# EAGLE design Relay Sequencer (EAGLE 7.7.0)
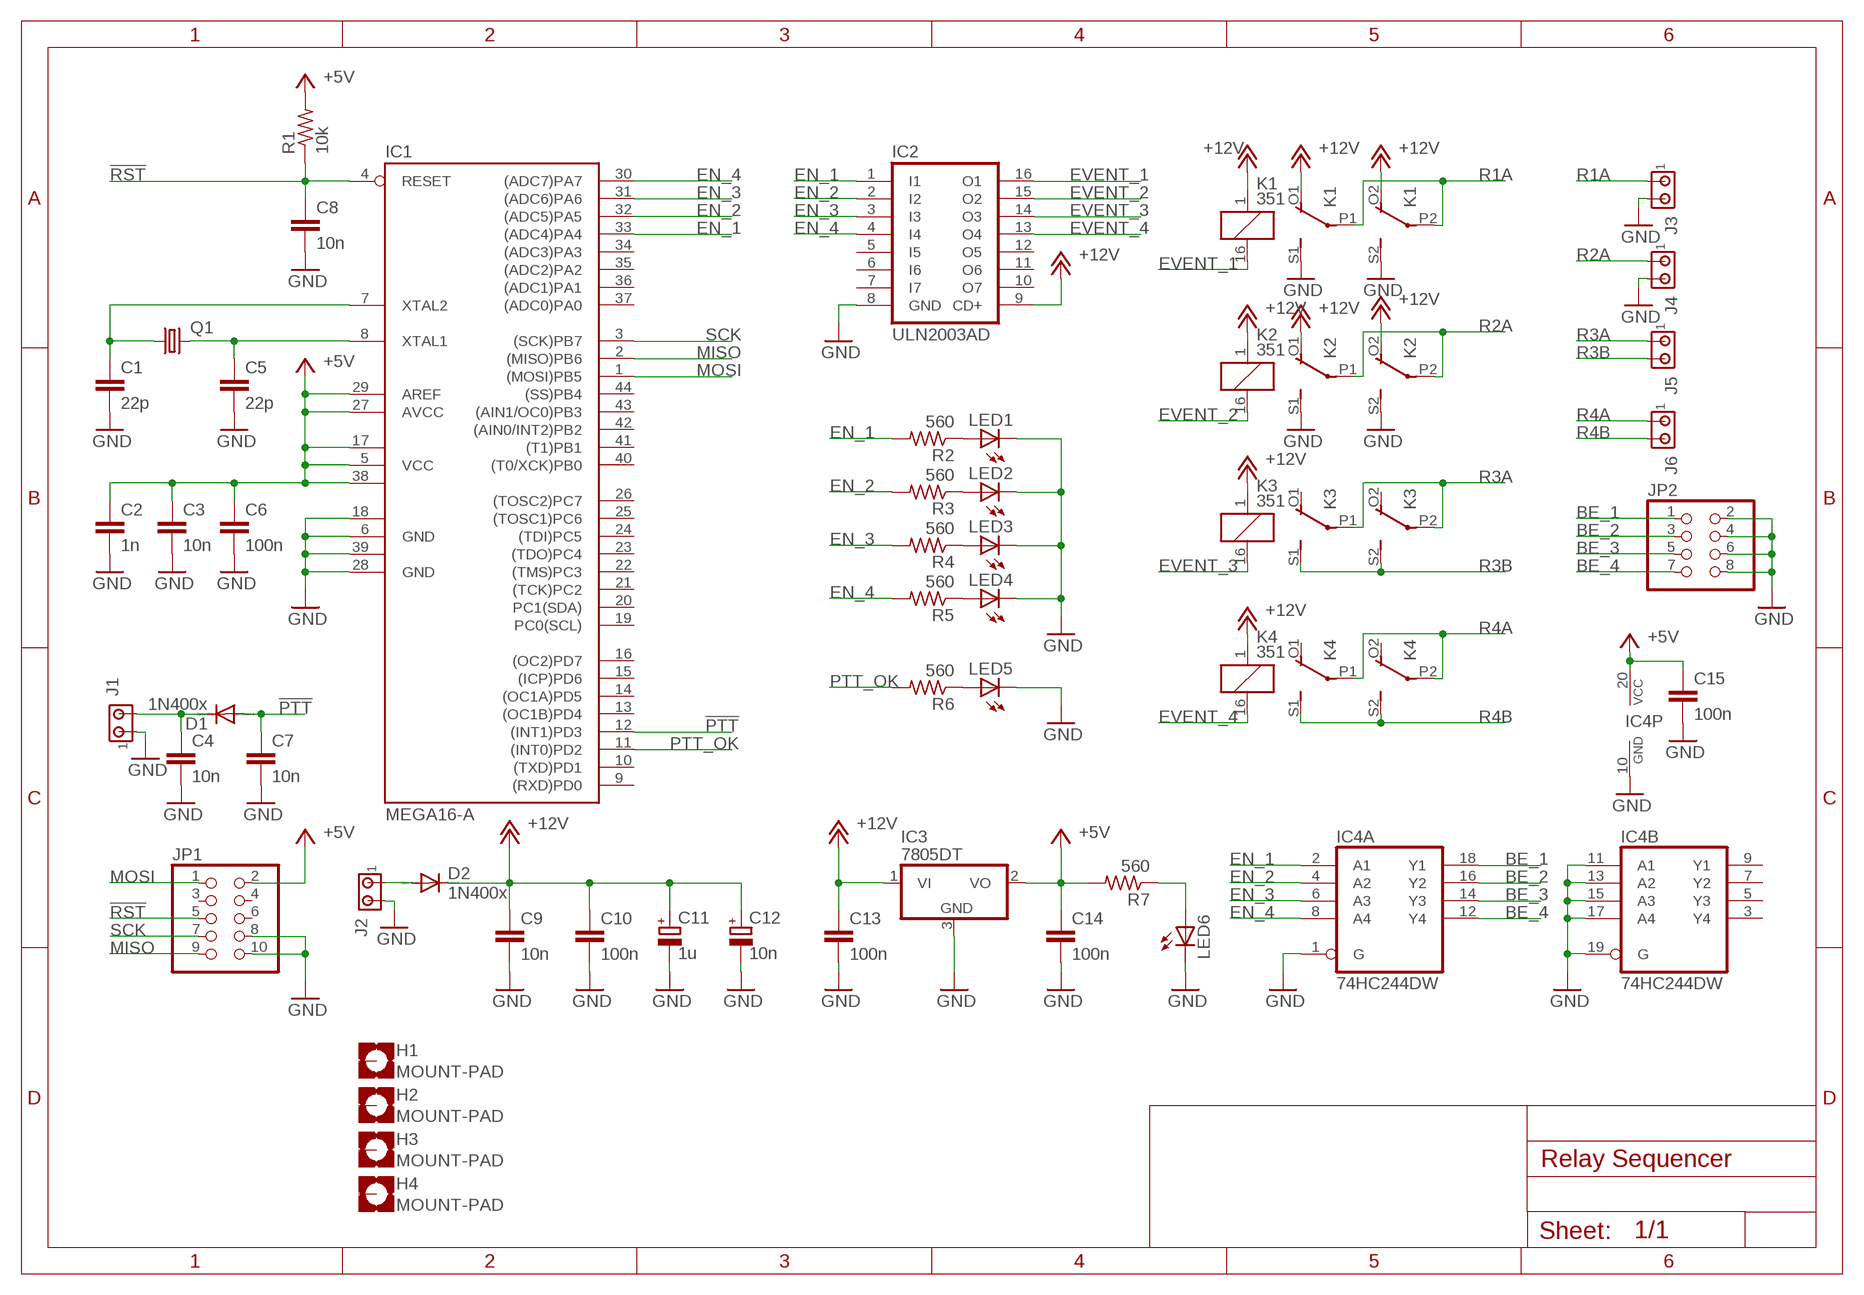
[diagram p0: schematic, sheet 1]

## Parts
C1  22p  C-EUC1206  [C1206]
C2  1n  C-EUC1206  [C1206]
C3  10n  C-EUC1206  [C1206]
C4  10n  C-EUC1206  [C1206]
C5  22p  C-EUC1206  [C1206]
C6  100n  C-EUC1206  [C1206]
C7  10n  C-EUC1206  [C1206]
C8  10n  C-EUC1206  [C1206]
C9  10n  C-EUC1206  [C1206]
C10  100n  C-EUC1206  [C1206]
C11  1u  CPOL-EUE5-8.5  [E5-8,5]
C12  10n  CPOL-EUE5-13  [E5-13]
C13  100n  C-EUC1206  [C1206]
C14  100n  C-EUC1206  [C1206]
C15  100n  C-EUC1206  [C1206]
D1  1N400x  1N4148DO35-10  [DO35-10]
D2  1N400x  1N4148DO35-10  [DO35-10]
H1  MOUNT-PAD  MOUNT-PAD-SQUARE2.8  [2,8-PAD-SQUARE]
H2  MOUNT-PAD  MOUNT-PAD-SQUARE2.8  [2,8-PAD-SQUARE]
H3  MOUNT-PAD  MOUNT-PAD-SQUARE2.8  [2,8-PAD-SQUARE]
H4  MOUNT-PAD  MOUNT-PAD-SQUARE2.8  [2,8-PAD-SQUARE]
IC1  MEGA16-A  [TQFP44]
IC2  ULN2003AD  [SO16]
IC3  7805DT  [TO252]
IC4  74HC244DW  [SO20W]
J1  MTA02-156  [1X2MTA]
J2  MTA02-156  [1X2MTA]
J3  MTA02-156  [1X2MTA]
J4  MTA02-156  [1X2MTA]
J5  MTA02-156  [1X2MTA]
J6  MTA02-156  [1X2MTA]
JP1  PINHD-2X5  [2X05]
JP2  PINHD-2X4  [2X04]
K1  351  [351]
K2  351  [351]
K3  351  [351]
K4  351  [351]
LED1  LED3MM  [LED3MM]
LED2  LED3MM  [LED3MM]
LED3  LED3MM  [LED3MM]
LED4  LED3MM  [LED3MM]
LED5  LED3MM  [LED3MM]
LED6  LED3MM  [LED3MM]
Q1  CRYSTALHC49S  [HC49/S]
R1  10k  R-US_M1206  [M1206]
R2  560  R-US_M1206  [M1206]
R3  560  R-US_M1206  [M1206]
R4  560  R-US_M1206  [M1206]
R5  560  R-US_M1206  [M1206]
R6  560  R-US_M1206  [M1206]
R7  560  R-US_M1206  [M1206]

## Nets
!PTT: C7.1 D1.A IC1.12((INT1)PD3)
!RST: C8.1 IC1.4(RESET) JP1.5 R1.1
+5V: C2.1 C3.1 C6.1 C14.1 C15.1 IC1.5(VCC) IC1.17(VCC1) IC1.27(AVCC) IC1.29(AREF) IC1.38(VCC2) IC3.2(VO) IC4.20(P:VCC) JP1.2 R1.2 R7.2
+12V: C9.1 C10.1 C11.+ C12.+ C13.1 D2.C IC2.9(CD+) IC3.1(VI) K1.1 K1.O1(2:O) K1.O2(3:O) K2.1 K2.O1(2:O) K2.O2(3:O) K3.1 K4.1
BE_1: IC4.18(A:Y1) JP2.1
BE_2: IC4.16(A:Y2) JP2.3
BE_3: IC4.14(A:Y3) JP2.5
BE_4: IC4.12(A:Y4) JP2.7
EN_1: IC1.33((ADC4)PA4) IC2.1(I1) IC4.2(A:A1) R2.2
EN_2: IC1.32((ADC5)PA5) IC2.2(I2) IC4.4(A:A2) R3.2
EN_3: IC1.31((ADC6)PA6) IC2.3(I3) IC4.6(A:A3) R4.2
EN_4: IC1.30((ADC7)PA7) IC2.4(I4) IC4.8(A:A4) R5.2
EVENT_1: IC2.16(O1) K1.16
EVENT_2: IC2.15(O2) K2.16
EVENT_3: IC2.14(O3) K3.16
EVENT_4: IC2.13(O4) K4.16
GND: C1.2 C2.2 C3.2 C4.2 C5.2 C6.2 C7.2 C8.2 C9.2 C10.2 C11.- C12.- C13.2 C14.2 C15.2 IC1.6(GND) IC1.18(GND1) IC1.28(GND) IC1.39(GND2) IC2.8(GND) IC3.3(GND) IC4.1(A:G) IC4.10(P:GND) IC4.11(B:A1) IC4.13(B:A2) IC4.15(B:A3) IC4.17(B:A4) IC4.19(B:G) J1.1 J2.2 J3.2 J4.2 JP1.8 JP1.10 JP2.2 JP2.4 JP2.6 JP2.8 K1.S1(2:S) K1.S2(3:S) K2.S1(2:S) K2.S2(3:S) LED1.K(C) LED2.K(C) LED3.K(C) LED4.K(C) LED5.K(C) LED6.K(C)
MISO: IC1.2((MISO)PB6) JP1.9
MOSI: IC1.1((MOSI)PB5) JP1.1
N$1: C5.1 IC1.8(XTAL1) Q1.2
N$2: C1.1 IC1.7(XTAL2) Q1.1
N$3: LED3.A R4.1
N$4: LED4.A R5.1
N$5: LED1.A R2.1
N$6: LED2.A R3.1
N$7: LED5.A R6.1
N$8: C4.1 D1.C J1.2
N$9: D2.A J2.1
N$10: LED6.A R7.1
PTT_OK: IC1.11((INT0)PD2) R6.2
R1A: J3.1 K1.P1(2:P) K1.P2(3:P)
R2A: J4.1 K2.P1(2:P) K2.P2(3:P)
R3A: J5.1 K3.P1(2:P) K3.P2(3:P)
R3B: J5.2 K3.S1(2:S) K3.S2(3:S)
R4A: J6.1 K4.P1(2:P) K4.P2(3:P)
R4B: J6.2 K4.S1(2:S) K4.S2(3:S)
SCK: IC1.3((SCK)PB7) JP1.7
Unconnected: H1.B2,8(MOUNT) H2.B2,8(MOUNT) H3.B2,8(MOUNT) H4.B2,8(MOUNT) IC1.9((RXD)PD0) IC1.10((TXD)PD1) IC1.13((OC1B)PD4) IC1.14((OC1A)PD5) IC1.15((ICP)PD6) IC1.16((OC2)PD7) IC1.19(PC0(SCL)) IC1.20(PC1(SDA)) IC1.21((TCK)PC2) IC1.22((TMS)PC3) IC1.23((TDO)PC4) IC1.24((TDI)PC5) IC1.25((TOSC1)PC6) IC1.26((TOSC2)PC7) IC1.34((ADC3)PA3) IC1.35((ADC2)PA2) IC1.36((ADC1)PA1) IC1.37((ADC0)PA0) IC1.40((T0/XCK)PB0) IC1.41((T1)PB1) IC1.42((AIN0/INT2)PB2) IC1.43((AIN1/OC0)PB3) IC1.44((SS)PB4) IC2.5(I5) IC2.6(I6) IC2.7(I7) IC2.10(O7) IC2.11(O6) IC2.12(O5) IC4.3(B:Y4) IC4.5(B:Y3) IC4.7(B:Y2) IC4.9(B:Y1) JP1.3 JP1.4 JP1.6 K3.O1(2:O) K3.O2(3:O) K4.O1(2:O) K4.O2(3:O)

## Library data of the parts
C1-C10 C13-C15 = rcl:C-EU: CAPACITOR, European symbol
C11 C12 = rcl:CPOL-EU: POLARIZED CAPACITOR, European symbol
D1 D2 = diode:1N4148: DIODE high speed (Philips)
H1-H4 = holes:MOUNT-PAD-SQUARE: MOUNTING PAD, square
IC1 = atmel:MEGA16: MICROCONTROLLER 16 Kbytes FLASH 1 kbytes SRAM 512 bytes EEPROM USART 8-channel 10 bit ADC Source: avr.lbr; MPN: ATMEGA16-16AU; OC_FARNELL: 9171134; OC_NEWARK: 96K6515
IC2 = uln-udn:ULN2003A: DRIVER ARRAY
IC3 = linear:78*: Positive VOLTAGE REGULATOR Source: http://cache.national.com/ds/LM/LM78L05.pdf http://www.fairchildsemi.com/ds/LM/LM7805.pdf
IC4 = 74xx-eu:74*244: Octal BUFFER and LINE DRIVER, 3-state
J1-J6 = con-amp:MTA02-156: AMP connector
JP1 = pinhead:PINHD-2X5: PIN HEADER
JP2 = pinhead:PINHD-2X4: PIN HEADER
K1-K4 = relay:351: RELAY 2 x switch, Omron; OC_FARNELL: unknown; OC_NEWARK: unknown
LED1-LED6 = led:LED: LED OSRAM: - CHIPLED LG R971, LG N971, LY N971, LG Q971, LY Q971, LO R971, LY R971 LH N974, LH R974 LS Q976, LO Q976, LY Q976 LO Q996 - Hyper CHIPLED LW Q18S LB Q993, LB Q99A, LB R99A - SideLED LS A670, LO A670, LY A670, LG A670, LP A670 LB A673, LV A673, LT A673, LW A673 LH A674 LY A675 LS A676, LA A676, LO A676, LY A676, LW A676 LS A679, LY A679, LG A679 - Hyper Micro SIDELED® LS Y876, LA Y876, LO Y876, LY Y876 LT Y87S - SmartLED LW L88C, LW L88S LB L89C, LB L89S, LG L890 LS L89K, LO L89K, LY L89K LS L896, LA L896, LO L896, LY L896 - TOPLED LS T670, LO T670, LY T670, LG T670, LP T670 LSG T670, LSP T670, LSY T670, LOP T670, LYG T670 LG T671, LOG T671, LSG T671 LB T673, LV T673, LT T673, LW T673 LH T674 LS T676, LA T676, LO T676, LY T676, LB T676, LH T676, LSB T676, LW T676 LB T67C, LV T67C, LT T67C, LS T67K, LO T67K, LY T67K, LW E67C LS E67B, LA E67B, LO E67B, LY E67B, LB E67C, LV E67C, LT E67C LW T67C LS T679, LY T679, LG T679 LS T770, LO T770, LY T770, LG T770, LP T770 LB T773, LV T773, LT T773, LW T773 LH T774 LS E675, LA E675, LY E675, LS T675 LS T776, LA T776, LO T776, LY T776, LB T776 LHGB T686 LT T68C, LB T68C - Hyper Mini TOPLED® LB M676 - Mini TOPLED Santana® LG M470 LS M47K, LO M47K, LY M47K Source: http://www.osram.convergy.de LUXEON: - LUMILED® LXK2-PW12-R00, LXK2-PW12-S00, LXK2-PW14-U00, LXK2-PW14-V00 LXK2-PM12-R00, LXK2-PM12-S00, LXK2-PM14-U00 LXK2-PE12-Q00, LXK2-PE12-R00, LXK2-PE12-S00, LXK2-PE14-T00, LXK2-PE14-U00 LXK2-PB12-K00, LXK2-PB12-L00, LXK2-PB12-M00, LXK2-PB14-N00, LXK2-PB14-P00, LXK2-PB14-Q00 LXK2-PR12-L00, LXK2-PR12-M00, LXK2-PR14-Q00, LXK2-PR14-R00 LXK2-PD12-Q00, LXK2-PD12-R00, LXK2-PD12-S00 LXK2-PH12-R00, LXK2-PH12-S00 LXK2-PL12-P00, LXK2-PL12-Q00, LXK2-PL12-R00 Source: www.luxeon.com KINGBRIGHT: KA-3528ASYC Source: www.kingbright.com
Q1 = crystal:CRYSTAL: CRYSTAL; OC_FARNELL: 1667008; OC_NEWARK: unknown
R1-R7 = rcl:R-US_: RESISTOR, American symbol

## Board
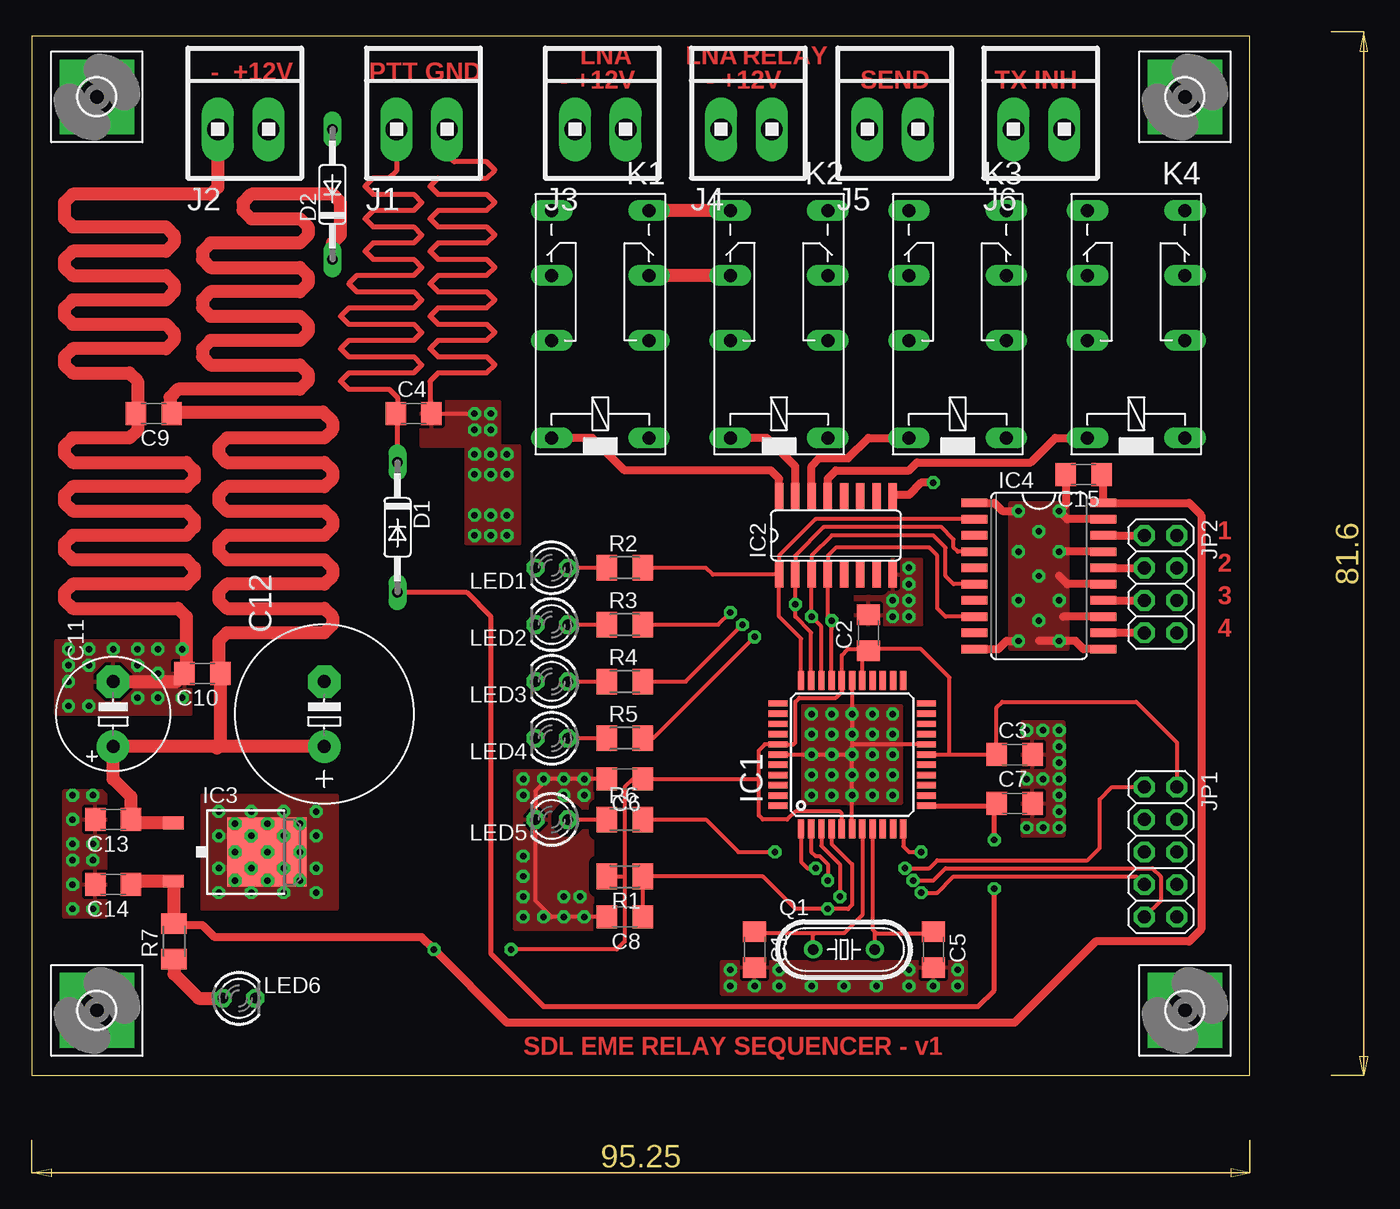
[diagram p1: board, top side]
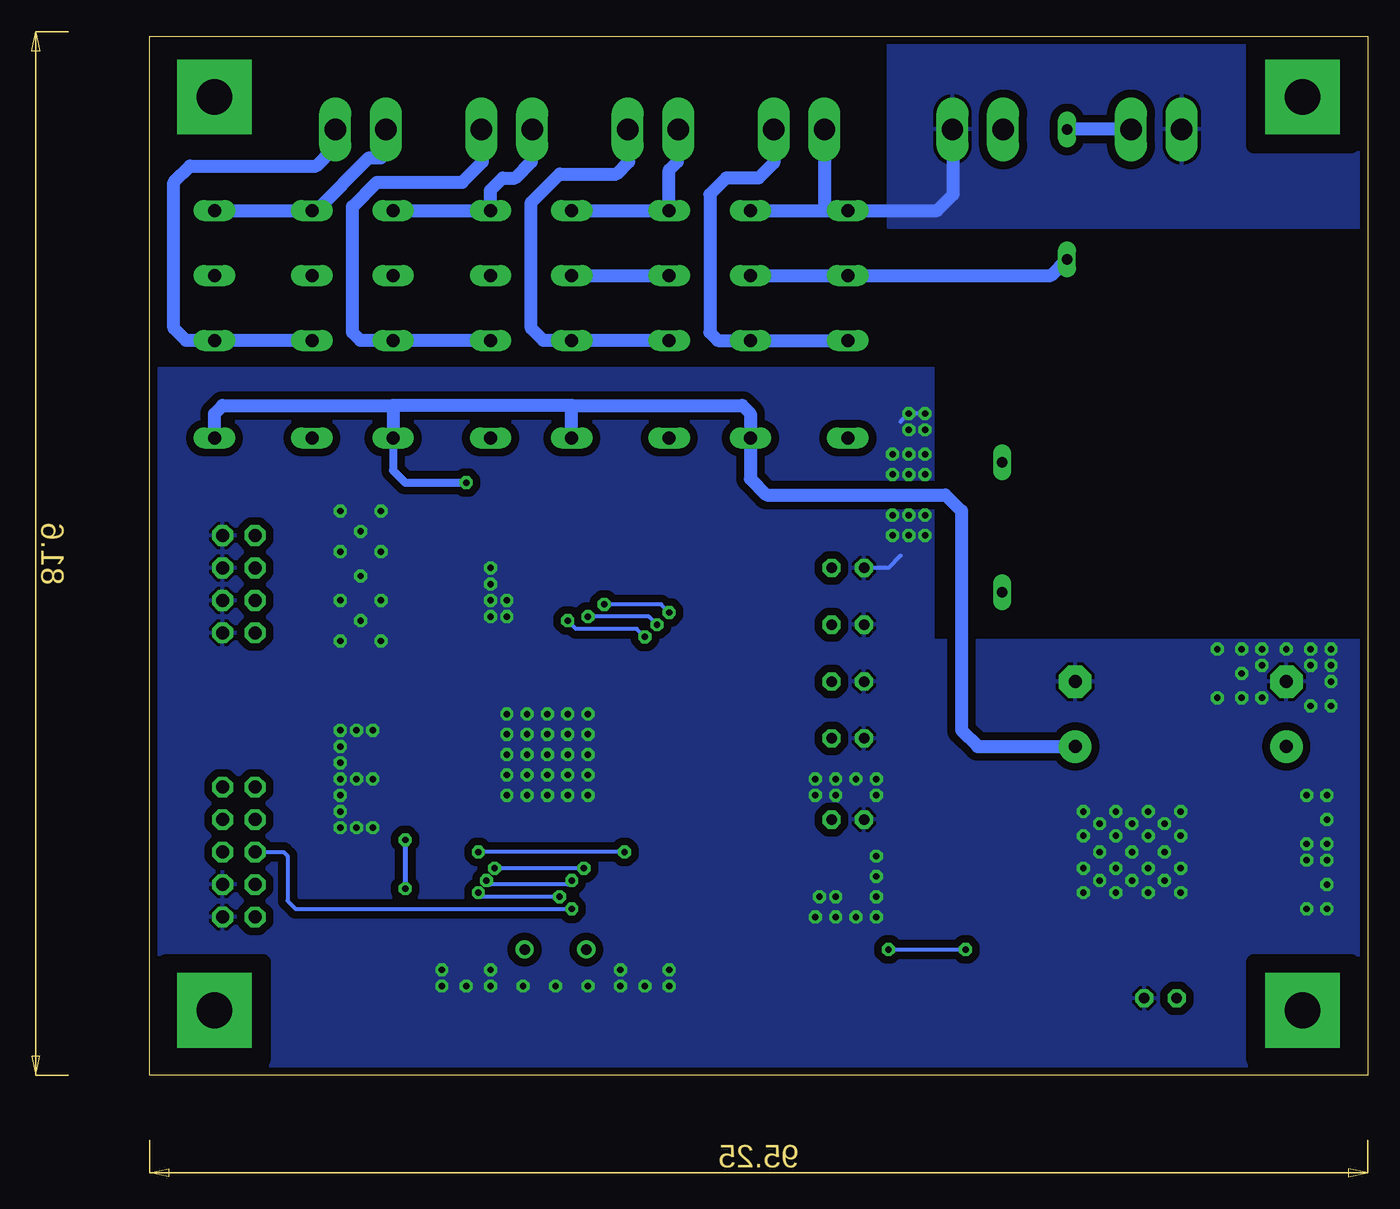
[diagram p2: board, bottom side, seen from below]

Size 95.23 x 81.27 mm. Coordinates in mm from the lower left corner, seen from the top.
Outline: 0,0 95.23,0 95.23,81.27 0,81.27 0,0
Copper layers (1*16): Top 0.035mm / dielectric 1.5mm / Bottom 0.035mm
Design rules "SparkFun": minimum track width 8mil, minimum drill 20mil, track to track 8mil, track to pad 8mil, pad to pad 8mil, via to via 8mil, smd to smd 8mil, copper to edge 10mil, drill to drill 8mil, minimum pad ring 12mil, minimum via ring 10mil, stop-mask expansion 4mil, vias tented up to drill 25mil, thermal gap 10mil
bRestrict: area 1.3,1.3 to 8.9,8.9; area 86.4,1.3 to 94,8.9; area 1.3,72.7 to 8.9,80.3; area 86.4,72.7 to 94,80.3

### Footprints (pad centres in the part's own frame; a part is rotated, then mirrored left to right if it is on the bottom)
C1206 = smd 1.6 x 1.8: 1 -1.4,0; 2 1.4,0
E5-8,5 = drill 1.016 pad 2.54: + -2.54,0 | drill 1.016 pad 2.54 octagon: - 2.54,0
E5-13 = drill 1.016 pad 2.54: + -2.54,0 | drill 1.016 pad 2.54 octagon: - 2.54,0
DO35-10 = drill 0.813 long: A 5.08,0; C -5.08,0
2,8-PAD-SQUARE = drill 2.8 pad 5.842 square: B2,8 0,0
TQFP44 = smd 1.5 x 0.5: 1 -5.8,4; 2 -5.8,3.2; 3 -5.8,2.4; 4 -5.8,1.6; 5 -5.8,0.8; 6 -5.8,0; 7 -5.8,-0.8; 8 -5.8,-1.6; 9 -5.8,-2.4; 10 -5.8,-3.2; 11 -5.8,-4; 23 5.8,-4; 24 5.8,-3.2; 25 5.8,-2.4; 26 5.8,-1.6; 27 5.8,-0.8; 28 5.8,0; 29 5.8,0.8; 30 5.8,1.6; 31 5.8,2.4; 32 5.8,3.2; 33 5.8,4 | smd 0.5 x 1.5: 12 -4,-5.8; 13 -3.2,-5.8; 14 -2.4,-5.8; 15 -1.6,-5.8; 16 -0.8,-5.8; 17 0,-5.8; 18 0.8,-5.8; 19 1.6,-5.8; 20 2.4,-5.8; 21 3.2,-5.8; 22 4,-5.8; 34 4,5.8; 35 3.2,5.8; 36 2.4,5.8; 37 1.6,5.8; 38 0.8,5.8; 39 0,5.8; 40 -0.8,5.8; 41 -1.6,5.8; 42 -2.4,5.8; 43 -3.2,5.8; 44 -4,5.8
SO16 = smd 0.66 x 2.032: 1 -4.445,-3.073; 2 -3.175,-3.073; 3 -1.905,-3.073; 4 -0.635,-3.073; 5 0.635,-3.073; 6 1.905,-3.073; 7 3.175,-3.073; 8 4.445,-3.073; 9 4.445,3.073; 10 3.175,3.073; 11 1.905,3.073; 12 0.635,3.073; 13 -0.635,3.073; 14 -1.905,3.073; 15 -3.175,3.073; 16 -4.445,3.073
TO252 = smd 1 x 1.6: 1 -2.28,-4.8; 2 2.28,-4.8 | smd 5.4 x 6.2: 3 0,2.5
SO20W = smd 0.66 x 2.032: 1 -5.715,-5.029; 2 -4.445,-5.029; 3 -3.175,-5.029; 4 -1.905,-5.029; 5 -0.635,-5.029; 6 0.635,-5.029; 7 1.905,-5.029; 8 3.175,-5.029; 9 4.445,-5.029; 10 5.715,-5.029; 11 5.715,5.029; 12 4.445,5.029; 13 3.175,5.029; 14 1.905,5.029; 15 0.635,5.029; 16 -0.635,5.029; 17 -1.905,5.029; 18 -3.175,5.029; 19 -4.445,5.029; 20 -5.715,5.029
1X2MTA = drill 1.676 long: 1 1.981,0; 2 -1.981,0
2X05 = drill 1.016 octagon: 1 -5.08,-1.27; 2 -5.08,1.27; 3 -2.54,-1.27; 4 -2.54,1.27; 5 0,-1.27; 6 0,1.27; 7 2.54,-1.27; 8 2.54,1.27; 9 5.08,-1.27; 10 5.08,1.27
2X04 = drill 1.016 octagon: 1 -3.81,-1.27; 2 -3.81,1.27; 3 -1.27,-1.27; 4 -1.27,1.27; 5 1.27,-1.27; 6 1.27,1.27; 7 3.81,-1.27; 8 3.81,1.27
351 = drill 1.016 long: 1 -3.81,-3.81; 16 -3.81,3.81; O1 8.89,-3.81; O2 8.89,3.81; P1 3.81,-3.81; P2 3.81,3.81; S1 13.97,-3.81; S2 13.97,3.81
LED3MM = drill 0.813 octagon: A -1.27,0; K 1.27,0
HC49/S = drill 0.813: 1 -2.413,0; 2 2.413,0
M1206 = smd 1.6 x 2: 1 -1.4,0; 2 1.4,0

### Placement (x,y rotation side)
C1  56.52,9.84 270 top
C2  65.41,34.61 90 top
C3  76.83,25.08 0 top
C4  29.84,51.75 0 top
C5  70.48,9.84 270 top
C6  46.35,23.18 180 top
C7  76.83,21.27 0 top
C8  46.35,12.38 180 top
C9  9.53,51.75 180 top
C10  13.34,31.43 180 top
C11  6.35,28.26 90 top
C12  22.86,28.26 90 top
C13  6.35,20 180 top
C14  6.35,14.92 180 top
C15  82.23,46.99 180 top
D1  28.57,42.86 270 top
D2  23.5,68.9 90 top
H1  90.17,5.08 0 top
H2  5.08,76.52 0 top
H3  90.17,76.52 0 top
H4  5.08,5.08 0 top
IC1  64.14,25.08 90 top
IC2  62.87,42.23 0 top
IC3  15.88,17.46 270 top
IC4  78.74,39.05 270 top
J1  30.48,73.98 0 top
J2  16.51,73.98 0 top
J3  44.45,73.98 0 top
J4  55.88,73.98 0 top
J5  67.31,73.98 0 top
J6  78.74,73.98 0 top
JP1  88.27,17.46 270 top
JP2  88.27,38.42 270 top
K1  44.45,53.66 90 top
K2  58.42,53.66 90 top
K3  72.39,53.66 90 top
K4  86.36,53.66 90 top
LED1  40.64,39.69 180 top
LED2  40.64,35.24 180 top
LED3  40.64,30.8 180 top
LED4  40.64,26.35 180 top
LED5  40.64,20 180 top
LED6  16.19,6.03 0 top
Q1  63.5,9.84 0 top
R1  46.35,15.56 180 top
R2  46.35,39.69 0 top
R3  46.35,35.24 0 top
R4  46.35,30.8 0 top
R5  46.35,26.35 0 top
R6  46.35,20 0 top
R7  11.11,10.48 90 top

### Tracks (layer width: path | path; a pad name or v marks a point on that pad's centre or on a via)
!PTT  (via drill 0.5 pad 0.61)
  Top 0.305: 75.56,21.14 C7.1
  Top 0.406: IC1.12 75.25,21.08 C7.1 75.25,21.09 v75.25,18.42 | D1.A 33.97,37.78 35.88,35.88 35.88,9.53 40.01,5.4 73.98,5.4 75.25,6.67 v75.25,14.61
  Bottom 0.406: v75.25,18.42 v75.25,14.61
!RST  (via drill 0.5 pad 0.61)
  Top 0.305: C8.1 R1.1 57.15,15.56 59.69,13.02 v62.23,13.02 63.82,13.02 64.14,13.34 64.14,16.51 62.53,18.11 IC1.4
  Bottom 0.305: JP1.5 84.77,17.46 84.45,17.15 84.45,13.65 83.82,13.02 v62.23,13.02
+5V  (via drill 0.5 pad 0.61)
  Top 0.305: IC1.27 64.94,32.74 C2.1 | 71.75,25.08 C3.1 75.44,28.76 75.88,29.21 86.36,29.21 89.53,26.04 JP1.2 | 46.35,15.56 46.35,22.54 46.99,23.18 C6.1 56.83,23.18 | 46.35,15.56 46.35,10.48 45.72,9.84 v37.47,9.84 | R1.2 46.35,15.56 | IC1.17 71.75,25.08 | 71.75,25.08 71.75,31.12 69.53,33.34 65.53,33.34 C2.1 | C2.1 65.28,33.34 63.82,33.34 63.34,32.86 IC1.29 63.34,30 62.87,29.53 60.01,29.53 59.69,29.21 59.69,26.04 59.54,25.88 IC1.38 57.31,25.88 56.83,25.4 56.83,23.18 | IC1.5 63.34,20.49 63.18,20.64 59.69,20.64 59.05,20 57.15,20 56.83,20.32 56.83,23.18
  Top 0.61: R7.2 11.24,11.75 13.34,11.75 14.29,10.79 30.48,10.79 v31.43,9.84 37.15,4.13 76.83,4.13 83.19,10.48 90.49,10.48 91.44,11.43 91.44,43.82 90.49,44.77 IC4.20 83.77,46.85 C15.1
  Top 1.016: C14.1 8.01,15.18 IC3.2 11.11,15.15 R7.2
  Bottom 0.305: v37.47,9.84 v31.43,9.84
+12V  (via drill 0.5 pad 0.61)
  Top 0.61: v70.48,46.36 69.53,46.36 68.58,45.4 67.41,45.4 IC2.9
  Top 1.016: D2.C 23.5,65.09 24.13,65.72 24.13,68.26 23.5,68.9 17.14,68.9 16.51,68.26 16.51,67.63 17.14,66.99 20.95,66.99 21.59,66.36 21.59,65.72 20.95,65.09 13.97,65.09 13.34,64.45 13.34,63.82 13.97,63.18 20.95,63.18 21.59,62.55 21.59,61.91 20.95,61.28 13.97,61.28 13.34,60.64 13.34,60.01 13.97,59.37 20.95,59.37 21.59,58.74 21.59,58.1 20.95,57.47 13.97,57.47 13.34,56.83 13.34,56.2 13.97,55.56 20.95,55.56 21.59,54.93 21.59,54.29 20.95,53.66 11.43,53.66 10.79,53.02 10.79,51.88 | 10.79,51.88 C9.1 | 10.79,51.88 22.73,51.88 23.5,51.12 23.5,50.48 22.86,49.85 15.24,49.85 14.61,49.21 14.61,48.58 15.24,47.94 22.86,47.94 23.5,47.31 23.5,46.67 22.86,46.04 15.24,46.04 14.61,45.4 14.61,44.77 15.24,44.13 22.86,44.13 23.5,43.5 23.5,42.86 22.86,42.23 15.24,42.23 14.61,41.59 14.61,40.96 15.24,40.32 22.86,40.32 23.5,39.69 23.5,39.05 22.86,38.42 15.24,38.42 14.61,37.78 14.61,37.15 15.24,36.51 22.86,36.51 23.5,35.88 23.5,35.24 22.86,34.61 15.24,34.61 14.61,33.97 14.61,31.56 C10.1 14.73,25.85 14.61,25.72 | C12.+ 14.61,25.72 | 14.61,25.72 C11.+ 6.35,23.18 7.75,21.78 C13.1 8.01,19.74 IC3.1 | 14.47,25.59 14.61,25.72 | K2.O2 K1.O1
  Bottom 0.61: K3.1 76.2,47.31 75.25,46.36 v70.48,46.36
  Bottom 1.016: 40.01,62.55 K1.O2 K1.O1 24.77,62.55 D2.C | K4.1 90.17,51.75 89.53,52.39 76.2,52.39 | 62.23,52.39 48.9,52.39 48.26,51.75 K1.1 48.26,46.67 46.99,45.4 33.02,45.4 31.75,44.13 31.75,26.99 30.48,25.72 C12.+ | K2.1 62.23,52.39 | 62.23,52.39 76.2,52.39 | 76.2,52.39 K3.1 | K2.O1 K2.O2
BE_1
  Top 0.61: IC4.18 JP2.1
BE_2
  Top 0.61: IC4.16 JP2.3
BE_3
  Top 0.61: IC4.14 JP2.5
BE_4
  Top 0.61: JP2.7 IC4.12
EN_1
  Top 0.305: IC1.33 60.13,34.16 58.42,35.88 IC2.1 | IC4.2 61.28,43.5 58.42,40.64 IC2.1 | IC2.1 53.24,39.16 52.7,39.69 R2.2
EN_2  (via drill 0.5 pad 0.61)
  Top 0.305: IC1.32 60.94,34.63 59.69,35.88 v59.69,36.83 IC2.2 59.69,40.64 61.91,42.86 71.12,42.86 72.07,41.91 72.07,41.28 72.39,40.96 IC4.4 | R3.2 53.66,35.24 v54.61,36.2
  Bottom 0.305: v54.61,36.2 55.24,36.83 v59.69,36.83
EN_3  (via drill 0.5 pad 0.61)
  Top 0.305: IC1.31 61.73,35.1 v60.96,35.88 IC2.3 60.96,40.64 62.55,42.23 70.48,42.23 71.44,41.28 71.44,39.05 72.07,38.42 IC4.6 | R4.2 51.12,30.8 v55.56,35.24
  Bottom 0.305: v55.56,35.24 56.2,35.88 v60.96,35.88
EN_4  (via drill 0.5 pad 0.61)
  Top 0.305: IC1.30 62.53,34.93 | 62.53,34.93 62.53,35.57 62.23,35.88 IC2.4 62.23,40.64 62.87,41.28 70.17,41.28 70.8,40.64 70.8,36.51 71.44,35.88 IC4.8 | R5.2 48.58,26.35 v56.52,34.29 | v62.55,35.56 62.53,34.93
  Bottom 0.305: v56.52,34.29 57.15,34.93 61.91,34.93 v62.55,35.56
EVENT_1
  Top 0.61: IC2.16 58.42,46.67 57.78,47.31 46.35,47.31 43.81,49.85 K1.16
EVENT_2
  Top 0.61: IC2.15 59.69,47.62 57.47,49.85 K2.16
EVENT_3
  Top 0.61: IC2.14 60.96,47.62 61.59,48.26 63.82,48.26 65.41,49.85 K3.16
EVENT_4
  Top 0.61: IC2.13 62.23,46.67 62.87,47.31 68.58,47.31 69.22,47.94 78.11,47.94 80.01,49.85 K4.16
GND  (via drill 0.5 pad 0.61)
  Top 0.305: IC1.28 64.14,25.72 | IC1.18 64.3,25.88 64.14,25.72 | IC1.39 v64.14,25.08 | v64.14,25.08 64.14,25.72 | IC1.6 v64.14,25.08 | C4.2 v34.61,51.75 | C6.2 40.32,23.18 39.37,22.23 LED5.K 39.37,13.65 40.64,12.38 C8.2
  Top 0.406: C4.2 31.11,51.88 31.11,54.29 31.75,54.93 35.56,54.93 36.2,55.56 35.56,56.2 31.75,56.2 31.11,56.83 31.75,57.47 35.56,57.47 36.2,58.1 35.56,58.74 31.75,58.74 31.11,59.37 31.75,60.01 35.56,60.01 36.2,60.64 35.56,61.28 31.75,61.28 31.11,61.91 31.75,62.55 35.56,62.55 36.2,63.18 35.56,63.82 31.75,63.82 31.11,64.45 31.75,65.09 35.56,65.09 36.2,65.72 35.56,66.36 31.75,66.36 31.11,66.99 31.75,67.63 35.56,67.63 36.2,68.26 35.56,68.9 31.75,68.9 31.11,69.53 31.75,70.17 35.56,70.17 36.2,70.8 35.56,71.44 33.02,71.44 32.38,72.07 32.38,73.9 J1.1
  Top 0.61: IC4.17 v80.33,40.96 | IC4.19 80.96,43.5 v80.33,44.13 80.83,44.64 C15.2 | IC4.15 80.96,38.42 80.33,39.05 | IC4.13 80.64,35.88 | IC4.1 75.25,44.77 75.88,44.13 v77.15,44.13 | IC4.11 82.23,33.34 81.6,33.97 78.74,33.97 | IC4.10 75.56,33.34 76.2,33.97 v77.15,33.97
  Top 1.016: J2.2 14.53,69.46 13.97,68.9 3.17,68.9 2.54,68.26 2.54,66.99 3.17,66.36 10.48,66.36 11.11,65.72 11.11,65.09 10.48,64.45 3.17,64.45 2.54,63.82 2.54,63.18 3.17,62.55 10.48,62.55 11.11,61.91 11.11,61.28 10.48,60.64 3.17,60.64 2.54,60.01 2.54,59.37 3.17,58.74 10.48,58.74 11.11,58.1 11.11,57.47 10.48,56.83 3.17,56.83 2.54,56.2 2.54,55.56 3.17,54.93 7.62,54.93 8.26,54.29 8.26,51.88 | 8.26,51.88 C9.2 | 8.26,51.88 8.26,50.48 7.62,49.85 3.17,49.85 2.54,49.21 2.54,48.58 3.17,47.94 12.06,47.94 12.7,47.31 12.7,46.67 12.06,46.04 3.17,46.04 2.54,45.4 2.54,44.77 3.17,44.13 12.06,44.13 12.7,43.5 12.7,42.86 12.06,42.23 3.17,42.23 2.54,41.59 2.54,40.96 3.17,40.32 12.06,40.32 12.7,39.69 12.7,39.05 12.06,38.42 3.17,38.42 2.54,37.78 2.54,37.15 3.17,36.51 11.43,36.51 12.06,35.88 12.06,31.56 C10.2 11.3,30.8 C11.- | K2.S2 K1.S1
  Bottom 0.305: v34.61,51.75 v35.88,51.75 36.51,51.12 | 36.51,40.64 37.47,39.69 LED1.K
  Bottom 1.016: K1.S1 42.55,67.63 | 42.55,67.63 K1.S2 33.66,67.63 32.38,68.9 32.38,73.9 J1.1 | J3.2 42.47,67.7 42.55,67.63 | K2.S1 K2.S2 54.61,70.8 53.98,71.44 53.98,73.9 J4.2
  other vias: 60.96,28.26 67.31,28.26 67.31,21.91 60.96,21.91 60.96,25.08 67.31,25.08 64.14,28.26 64.14,21.91 62.55,23.5 65.72,23.5 65.72,26.67 62.55,26.67 60.96,26.67 62.55,28.26 65.72,28.26 64.14,26.67 67.31,26.67 65.72,25.08 67.31,23.5 65.72,21.91 62.55,21.91 64.14,23.5 62.55,25.08 60.96,23.5 54.61,6.99 54.61,8.26 56.52,6.99 58.42,6.99 58.42,8.26 70.48,6.99 72.39,6.99 72.39,8.26 68.58,6.99 68.58,8.26 63.5,6.99 60.96,6.99 66.04,6.99 43.18,12.38 43.18,23.18 41.59,12.38 40.01,12.38 38.42,12.38 38.42,23.18 40.01,23.18 41.59,23.18 42.86,13.97 41.59,13.97 41.59,21.91 38.42,21.91 38.42,17.15 38.42,13.97 15.88,15.24 20.95,15.24 20.95,19.69 15.88,19.69 15.88,17.46 20.95,17.46 18.41,15.24 18.41,19.69 18.41,17.46 17.14,18.73 19.68,18.73 19.68,16.19 17.14,16.19 4.76,21.91 4.76,18.1 4.76,16.83 4.76,13.02 3.17,13.02 3.17,14.92 3.17,16.83 3.17,18.1 3.17,20 3.17,21.91 67.31,35.88 67.31,37.15 68.58,35.88 68.58,37.15 68.58,38.42 68.58,39.69 77.79,19.37 79.06,19.37 80.33,19.37 80.33,21.91 80.33,23.18 79.06,23.18 77.79,23.18 77.79,26.99 79.06,26.99 80.33,26.99 80.33,25.72 80.33,20.64 80.33,24.45 14.61,20.64 17.14,20.64 19.68,20.64 22.23,18.73 22.23,16.19 19.68,14.29 22.23,14.29 17.14,14.29 14.61,14.29 14.61,16.19 14.61,18.73 22.23,20.64 38.42,15.56 43.18,21.91 34.61,48.58 35.88,48.58 37.15,48.58 34.61,46.99 35.88,46.99 37.15,46.99 34.61,43.82 35.88,43.82 37.15,43.82 34.61,42.23 35.88,42.23 37.15,42.23 34.61,50.48 35.88,50.48 9.84,31.43 9.84,33.34 11.75,33.34 11.75,29.53 9.84,29.53 6.35,33.34 8.26,33.34 4.45,33.34 2.86,33.34 2.86,30.8 2.86,28.89 2.86,32.07 4.45,32.07 8.26,32.07 8.26,29.53 4.45,28.89 78.74,42.55 77.15,40.96 78.74,39.05 77.15,37.15 80.33,37.15 78.74,35.56 80.33,33.97
  pour Top: 60.33,28.89 67.94,28.89 67.94,21.27 60.33,21.27
  pour Bottom (isolate 0.61): 33.97,55.25 95.25,55.25 95.25,0 0,0 0,33.97 33.97,33.97
  pour Top: 53.98,8.89 73.03,8.89 73.03,6.35 53.98,6.35
  pour Top (isolate 0.61): 37.78,23.81 43.81,23.81 43.81,11.43 37.78,11.43
  pour Top (isolate 0.61): 2.54,22.23 5.71,22.23 5.71,12.38 2.54,12.38
  pour Top (isolate 0.61, no thermals): 13.34,21.91 23.81,21.91 23.81,13.02 13.34,13.02
  pour Top (isolate 0.61): 64.45,40.32 69.53,40.32 69.53,35.24 64.45,35.24
  pour Top (isolate 0.61): 77.47,27.62 80.64,27.62 80.64,18.73 77.47,18.73
  pour Bottom (isolate 0.61): 0.32,80.96 37.47,80.96 37.47,66.36 0.32,66.36
  pour Top (isolate 0.61): 33.97,41.59 33.97,49.21 30.48,49.21 30.48,52.71 36.51,52.71 36.51,49.21 38.1,49.21 38.1,41.59
  pour Top: 1.91,33.97 12.38,33.97 12.38,28.26 1.91,28.26
  pour Top (isolate 0.61): 76.52,44.77 80.96,44.77 80.96,33.34 76.52,33.34
MISO  (via drill 0.5 pad 0.61)
  Top 0.305: IC1.2 60.94,17.49 61.28,17.15 61.59,17.15 62.23,16.51 v62.23,15.24 | v68.9,15.24 70.48,15.24 71.44,16.19 87.63,16.19 88.27,15.56 88.27,13.65 JP1.9
  Bottom 0.305: v62.23,15.24 62.55,14.92 68.58,14.92 v68.9,15.24
MOSI  (via drill 0.5 pad 0.61)
  Top 0.305: IC1.1 60.13,16.7 60.64,16.19 v61.28,16.19 | v68.26,16.19 70.17,16.19 70.8,16.83 82.55,16.83 83.5,17.78 83.5,21.59 84.45,22.54 JP1.1
  Bottom 0.305: v61.28,16.19 v68.26,16.19
N$1
  Top 0.305: IC1.8 65.73,11.42 65.91,11.24 | 65.91,11.24 66.04,11.11 70.36,11.11 C5.1 | Q1.2 65.91,11.24
N$2
  Top 0.305: IC1.7 64.94,12.55 63.5,11.11 60.96,11.11 | 60.96,11.11 56.65,11.11 C1.1 | Q1.1 61.09,10.99 60.96,11.11
N$3
  Top 0.305: LED3.A R4.1
N$4
  Top 0.305: R5.1 LED4.A
N$5
  Top 0.305: R2.1 LED1.A
N$6
  Top 0.305: LED2.A R3.1
N$7
  Top 0.305: LED5.A R6.1
N$8
  Top 0.406: J1.2 28.5,70.73 27.94,70.17 26.67,70.17 26.04,69.53 26.67,68.9 29.84,68.9 30.48,68.26 29.84,67.63 26.67,67.63 26.04,66.99 26.67,66.36 29.84,66.36 30.48,65.72 29.84,65.09 26.67,65.09 26.04,64.45 26.67,63.82 29.84,63.82 30.48,63.18 29.84,62.55 25.4,62.55 24.77,61.91 25.4,61.28 29.84,61.28 30.48,60.64 29.84,60.01 24.77,60.01 24.13,59.37 24.77,58.74 29.84,58.74 30.48,58.1 29.84,57.47 24.77,57.47 24.13,56.83 24.77,56.2 29.84,56.2 30.48,55.56 29.84,54.93 24.77,54.93 24.13,54.29 24.77,53.66 27.94,53.66 28.57,53.02 28.57,51.88 C4.1 28.57,51.62 D1.C
N$9
  Bottom 1.016: J2.1 D2.A
N$10
  Top 1.016: R7.1 11.11,7.94 13.02,6.03 LED6.A
PTT_OK  (via drill 0.5 pad 0.61)
  Top 0.305: IC1.11 68.14,17.91 68.58,17.46 v69.53,17.46 | R6.2 52.7,20 55.24,17.46 v58.1,17.46
  Bottom 0.305: v58.1,17.46 v69.53,17.46
R1A
  Bottom 1.016: K1.P2 K1.P1 50.8,57.47 51.44,58.1 51.44,68.9 50.16,70.17 47.62,70.17 46.43,71.36 J3.1
R2A
  Bottom 1.016: K2.P2 K2.P1 64.45,57.47 65.41,58.42 65.41,68.26 63.18,70.49 58.74,70.49 57.78,71.44 57.78,73.9 J4.1
R3A
  Bottom 1.016: K3.P1 K3.P2 78.74,57.47 79.38,58.1 79.38,67.94 77.47,69.85 70.8,69.85 69.22,71.44 69.22,73.9 J5.1
R3B
  Bottom 1.016: K3.S1 K3.S2 68.58,69.22 67.63,70.17 66.67,70.17 65.41,71.44 65.41,73.9 J5.2
R4A
  Bottom 1.016: K4.P1 K4.P2 92.39,57.47 93.34,58.42 93.34,69.85 92.08,71.12 82.23,71.12 80.96,72.39 80.96,73.74 J6.1
R4B
  Bottom 1.016: K4.S1 K4.S2 82.23,67.63 78.11,71.76 77.15,71.76 76.83,72.07 76.83,73.9 J6.2
SCK  (via drill 0.5 pad 0.61)
  Top 0.305: IC1.3 61.73,17.96 63.18,16.51 v63.18,13.97 | v69.53,14.29 70.8,14.29 72.07,15.56 86.36,15.56 JP1.7
  Bottom 0.305: v63.18,13.97 69.22,13.97 v69.53,14.29

### Text on the board
Top: LNA | LNA | RELAY | - +12V | PTT GND | - +12V | - +12V | SEND | TX INH | 1 | 2 | 3 | 4 | SDL EME RELAY SEQUENCER - v1